# EasyEDA Pro project split36_right.eprj

# Schematic split1_right
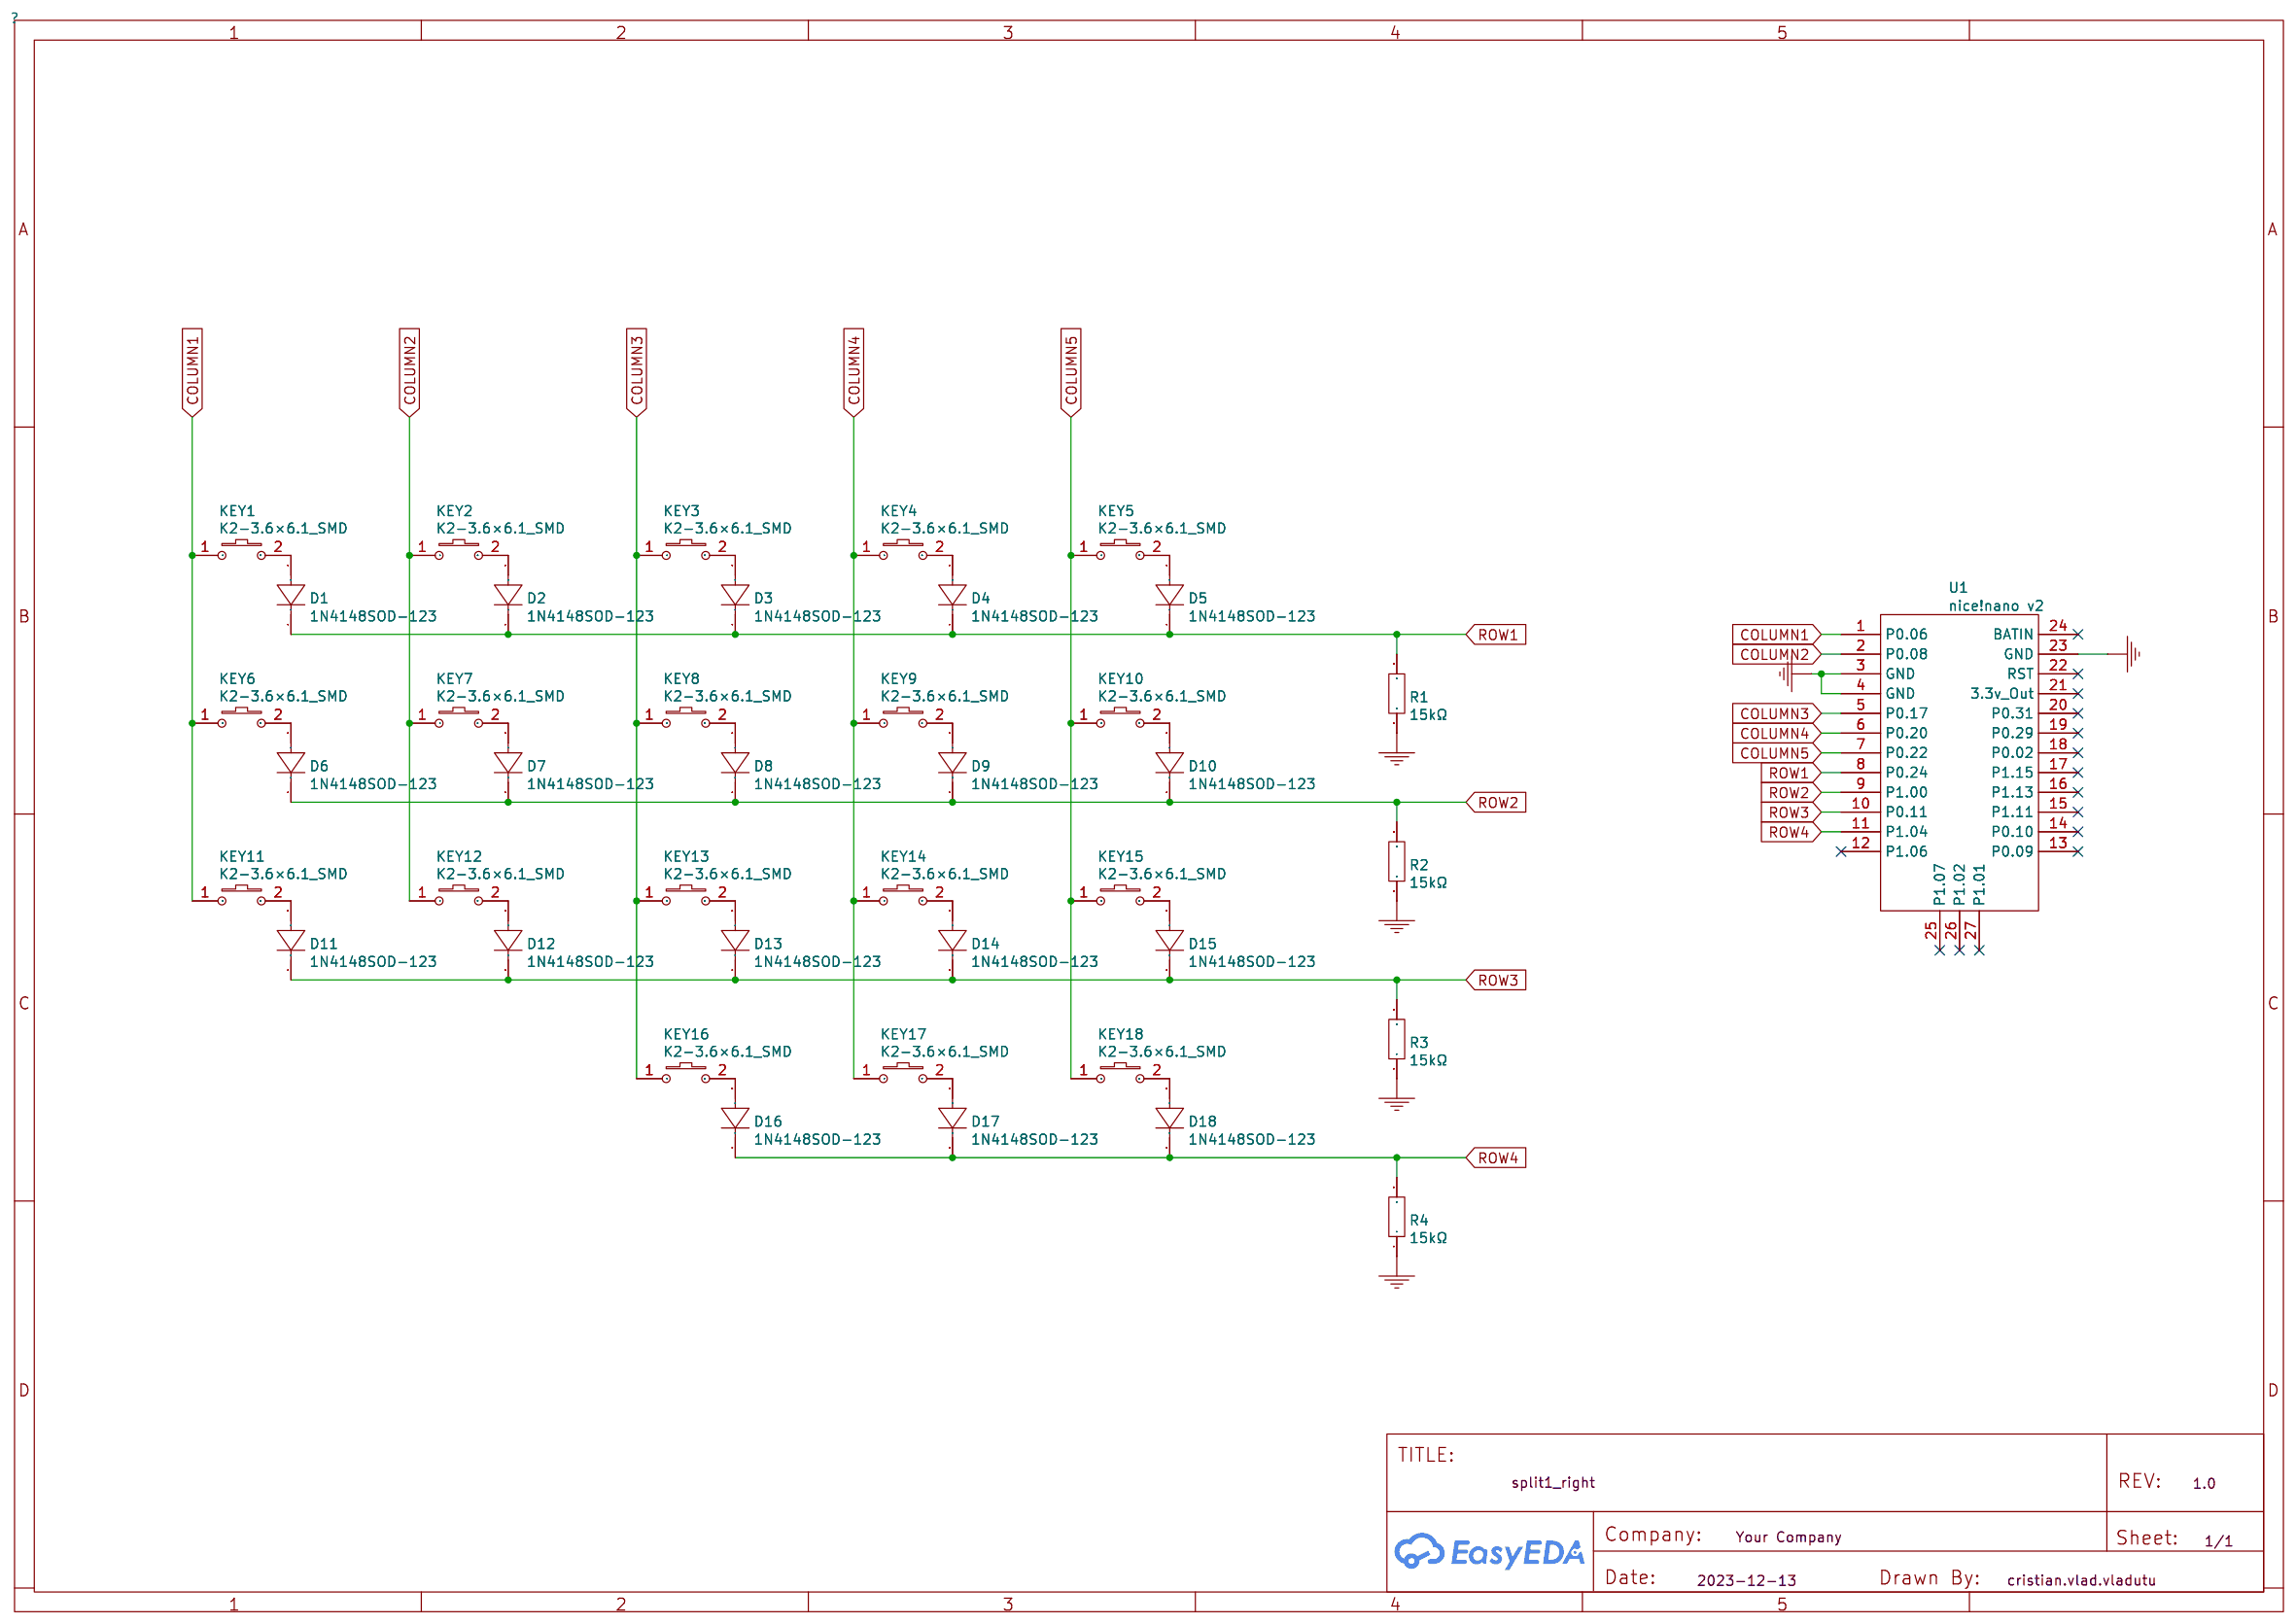
[diagram p0: schematic sheet]

## Parts
D1  1N4148SOD-123  [SOD-123_L2.6-W1.6-LS3.5-RD]
D2  1N4148SOD-123  [SOD-123_L2.6-W1.6-LS3.5-RD]
D3  1N4148SOD-123  [SOD-123_L2.6-W1.6-LS3.5-RD]
D4  1N4148SOD-123  [SOD-123_L2.6-W1.6-LS3.5-RD]
D5  1N4148SOD-123  [SOD-123_L2.6-W1.6-LS3.5-RD]
D6  1N4148SOD-123  [SOD-123_L2.6-W1.6-LS3.5-RD]
D7  1N4148SOD-123  [SOD-123_L2.6-W1.6-LS3.5-RD]
D8  1N4148SOD-123  [SOD-123_L2.6-W1.6-LS3.5-RD]
D9  1N4148SOD-123  [SOD-123_L2.6-W1.6-LS3.5-RD]
D10  1N4148SOD-123  [SOD-123_L2.6-W1.6-LS3.5-RD]
D11  1N4148SOD-123  [SOD-123_L2.6-W1.6-LS3.5-RD]
D12  1N4148SOD-123  [SOD-123_L2.6-W1.6-LS3.5-RD]
D13  1N4148SOD-123  [SOD-123_L2.6-W1.6-LS3.5-RD]
D14  1N4148SOD-123  [SOD-123_L2.6-W1.6-LS3.5-RD]
D15  1N4148SOD-123  [SOD-123_L2.6-W1.6-LS3.5-RD]
D16  1N4148SOD-123  [SOD-123_L2.6-W1.6-LS3.5-RD]
D17  1N4148SOD-123  [SOD-123_L2.6-W1.6-LS3.5-RD]
D18  1N4148SOD-123  [SOD-123_L2.6-W1.6-LS3.5-RD]
KEY1  K2-3.6×6.1_SMD  [GATERON LOW PROFILE SWITCH HOTSWAP LED]
KEY2  K2-3.6×6.1_SMD  [GATERON LOW PROFILE SWITCH HOTSWAP LED]
KEY3  K2-3.6×6.1_SMD  [GATERON LOW PROFILE SWITCH HOTSWAP LED]
KEY4  K2-3.6×6.1_SMD  [GATERON LOW PROFILE SWITCH HOTSWAP LED]
KEY5  K2-3.6×6.1_SMD  [GATERON LOW PROFILE SWITCH HOTSWAP LED]
KEY6  K2-3.6×6.1_SMD  [GATERON LOW PROFILE SWITCH HOTSWAP LED]
KEY7  K2-3.6×6.1_SMD  [GATERON LOW PROFILE SWITCH HOTSWAP LED]
KEY8  K2-3.6×6.1_SMD  [GATERON LOW PROFILE SWITCH HOTSWAP LED]
KEY9  K2-3.6×6.1_SMD  [GATERON LOW PROFILE SWITCH HOTSWAP LED]
KEY10  K2-3.6×6.1_SMD  [GATERON LOW PROFILE SWITCH HOTSWAP LED]
KEY11  K2-3.6×6.1_SMD  [GATERON LOW PROFILE SWITCH HOTSWAP LED]
KEY12  K2-3.6×6.1_SMD  [GATERON LOW PROFILE SWITCH HOTSWAP LED]
KEY13  K2-3.6×6.1_SMD  [GATERON LOW PROFILE SWITCH HOTSWAP LED]
KEY14  K2-3.6×6.1_SMD  [GATERON LOW PROFILE SWITCH HOTSWAP LED]
KEY15  K2-3.6×6.1_SMD  [GATERON LOW PROFILE SWITCH HOTSWAP LED]
KEY16  K2-3.6×6.1_SMD  [GATERON LOW PROFILE SWITCH HOTSWAP LED]
KEY17  K2-3.6×6.1_SMD  [GATERON LOW PROFILE SWITCH HOTSWAP LED]
KEY18  K2-3.6×6.1_SMD  [GATERON LOW PROFILE SWITCH HOTSWAP LED]
R1  15kΩ  [R0402]
R2  15kΩ  [R0402]
R3  15kΩ  [R0402]
R4  15kΩ  [R0402]
U1  nice!nano v2  [NICE!NANO V2]

## Library data of the parts
D1-D18 = 1N4148SOD-123: link: https://lcsc.com/eda_search?q=C2972760&amp;%26type=1&amp;ref=editor; Supplier: LCSC; Supplier Part: C2972760; Manufacturer: JKSEMI(金开盛); JLCPCB Part Class: Extended Part
KEY1-KEY18 = K2-3.6×6.1_SMD: Supplier Part: C118141; Supplier: LCSC; Manufacturer Part: K2-1107ST-A4SW-06; 制造商: 韩国韩荣
R1-R4 = 15kΩ: link: https://lcsc.com/eda_search?q=C325957&amp;%26type=1&amp;ref=editor; 3DModel: R0402_L1.0-W0.5-H0.5; Supplier: LCSC; Supplier Part: C325957; Manufacturer: Tyohm(幸亚电阻); Manufacturer Part: RMC040215K5%N; JLCPCB Part Class: Extended Part
U1 = nice!nano v2: link: https://nicekeyboards.com/docs/nice-nano/pinout-schematic; Manufacturer: nice!

## Nets
GND: R1.1 R2.1 R3.1 R4.1 U1.3(GND) U1.4(GND) U1.23(GND)
COLUMN1: KEY1.1 KEY6.1 KEY11.1 U1.1(P0.06)
COLUMN2: KEY2.1 KEY7.1 KEY12.1 U1.2(P0.08)
COLUMN3: KEY3.1 KEY8.1 KEY13.1 KEY16.1 U1.5(P0.17)
COLUMN4: KEY4.1 KEY9.1 KEY14.1 KEY17.1 U1.6(P0.20)
COLUMN5: KEY5.1 KEY10.1 KEY15.1 KEY18.1 U1.7(P0.22)
ROW1: D1.1(K) D2.1(K) D3.1(K) D4.1(K) D5.1(K) R1.2 U1.8(P0.24)
ROW2: D6.1(K) D7.1(K) D8.1(K) D9.1(K) D10.1(K) R2.2 U1.9(P1.00)
ROW3: D11.1(K) D12.1(K) D13.1(K) D14.1(K) D15.1(K) R3.2 U1.10(P0.11)
ROW4: D16.1(K) D17.1(K) D18.1(K) R4.2 U1.11(P1.04)
$1N745: D1.2(A) KEY1.2
$1N746: D2.2(A) KEY2.2
$1N747: D3.2(A) KEY3.2
$1N748: D4.2(A) KEY4.2
$1N749: D5.2(A) KEY5.2
$1N750: D10.2(A) KEY10.2
$1N751: D8.2(A) KEY8.2
$1N752: D7.2(A) KEY7.2
$1N753: D15.2(A) KEY15.2
$1N754: D14.2(A) KEY14.2
$1N755: D13.2(A) KEY13.2
$1N756: D12.2(A) KEY12.2
$1N757: D11.2(A) KEY11.2
$1N758: D16.2(A) KEY16.2
$1N759: D17.2(A) KEY17.2
$1N760: D18.2(A) KEY18.2
$1N761: D6.2(A) KEY6.2
$1N762: D9.2(A) KEY9.2

Not connected (* = marked no-connect by the designer): U1 12(P1.06)* 13(P0.09)* 14(P0.10)* 15(P1.11)* 16(P1.13)* 17(P1.15)* 18(P0.02)* 19(P0.29)* 20(P0.31)* 21(3.3v Out)* 22(RST)* 24(BATIN)* 25(P1.07)* 26(P1.02)* 27(P1.01)*

# Board PCB_split1_right
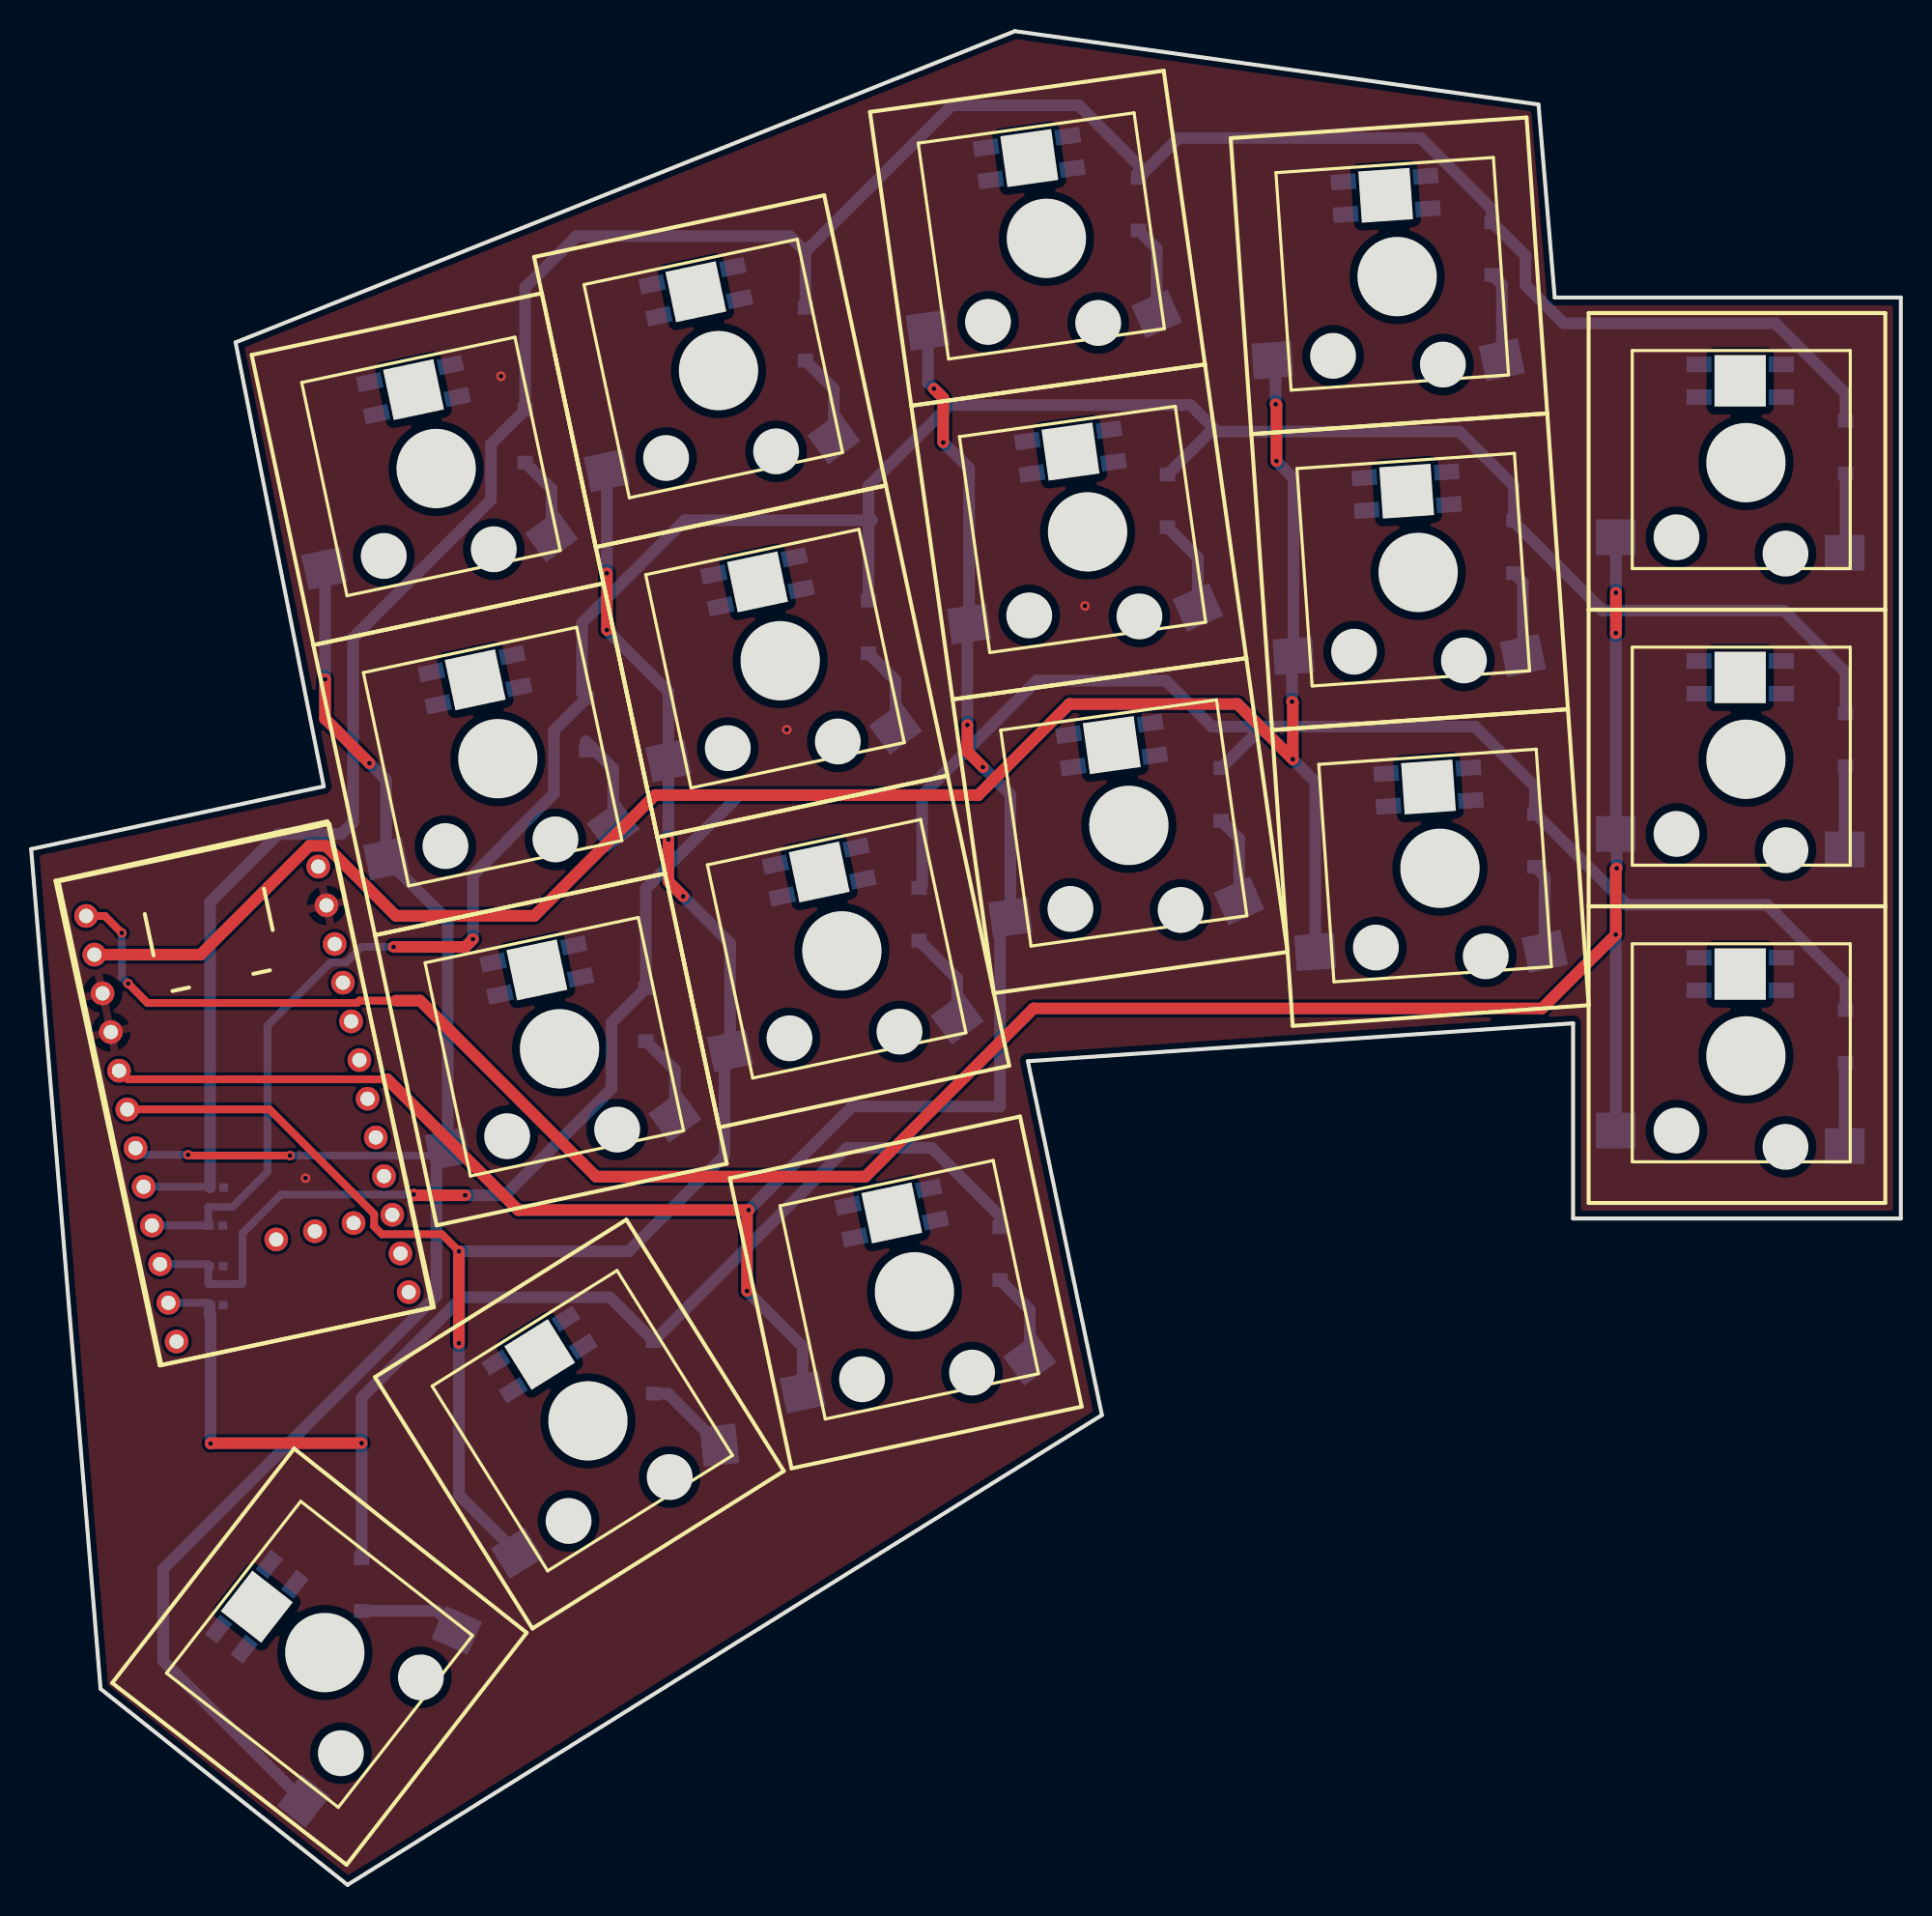
[diagram p1: board, top side]
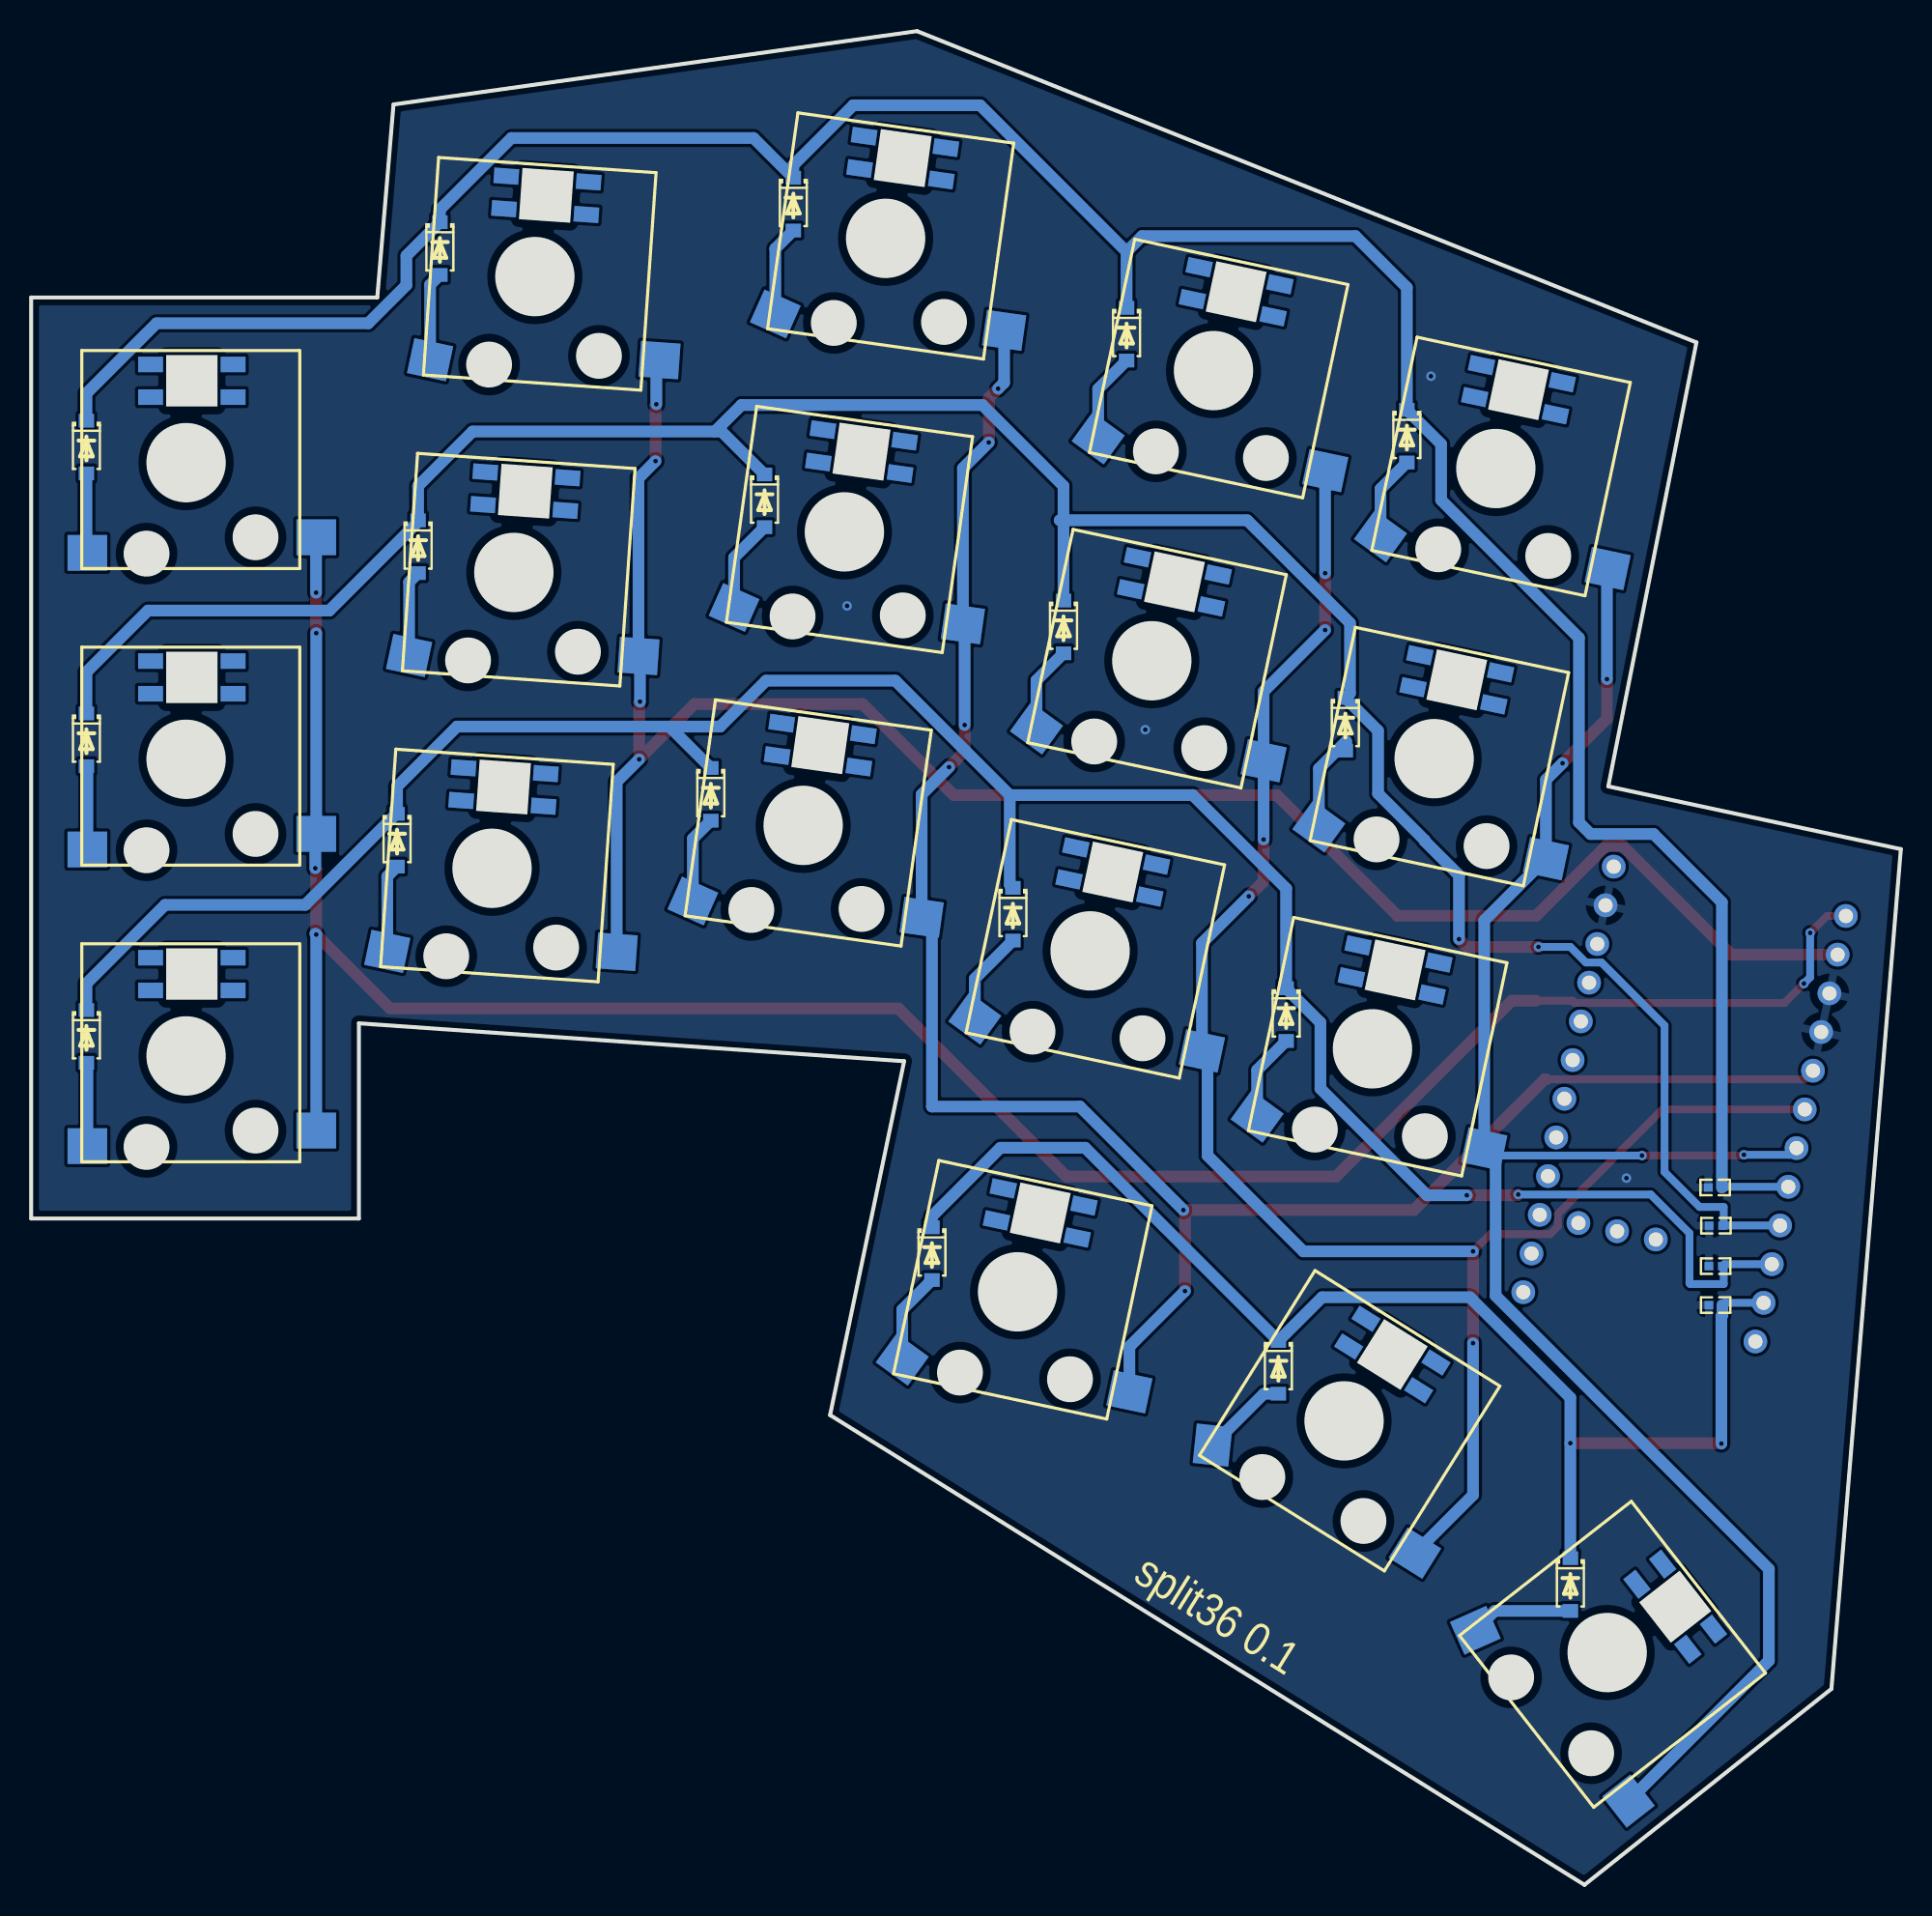
[diagram p2: board, bottom side, seen from below]

Outline 120.08 x 119.05 mm; copper layers: Top Layer, Bottom Layer. Coordinates in mm from the lower left corner of the outline.
Outline path: 0,66.52 18.79,70.55 13.13,99.06 63.18,119.05 96.81,114.34 97.85,101.94 120.08,101.94 120.08,42.79 99.03,42.79 99.03,55.33 64.01,52.9 68.77,30.17 20.32,0 4.46,12.59 0,66.52
Stack: Top Layer 0.035mm / Dielectric1 1.51mm FR4 er 4.5 / Bottom Layer 0.035mm

## Design rules (mm)
spacing Default (default): track to track 0.152, other pairs 0 to 0.152
track width Default (default): min 0.254, default 0.254, max 25.4
differential pair differentialPair (default): width min 0.127, default 0.254, max 2.54; gap min 0.152, default 0.152
via Default (default): diameter min 0.61, default 0.61, max 100.025; hole min 0.305, default 0.305, max 59.995
net GND uses gge22613(1)
pour e135 uses gge22613

## Placement (name value [footprint] x y rotation side)
D1  1N4148SOD-123  [SOD-123_L2.6-W1.6-LS3.5-RD]  116.53 92.34 270 bottom
D2  1N4148SOD-123  [SOD-123_L2.6-W1.6-LS3.5-RD]  93.83 105.09 270 bottom
D3  1N4148SOD-123  [SOD-123_L2.6-W1.6-LS3.5-RD]  71.13 107.94 270 bottom
D4  1N4148SOD-123  [SOD-123_L2.6-W1.6-LS3.5-RD]  49.73 99.59 270 bottom
D5  1N4148SOD-123  [SOD-123_L2.6-W1.6-LS3.5-RD]  31.73 93.04 270 bottom
D6  1N4148SOD-123  [SOD-123_L2.6-W1.6-LS3.5-RD]  116.53 73.54 270 bottom
D7  1N4148SOD-123  [SOD-123_L2.6-W1.6-LS3.5-RD]  95.23 85.94 270 bottom
D8  1N4148SOD-123  [SOD-123_L2.6-W1.6-LS3.5-RD]  72.98 88.89 270 bottom
D9  1N4148SOD-123  [SOD-123_L2.6-W1.6-LS3.5-RD]  53.78 80.79 270 bottom
D10  1N4148SOD-123  [SOD-123_L2.6-W1.6-LS3.5-RD]  35.68 74.54 270 bottom
D11  1N4148SOD-123  [SOD-123_L2.6-W1.6-LS3.5-RD]  116.53 54.49 270 bottom
D12  1N4148SOD-123  [SOD-123_L2.6-W1.6-LS3.5-RD]  96.58 67.09 270 bottom
D13  1N4148SOD-123  [SOD-123_L2.6-W1.6-LS3.5-RD]  76.43 70.04 270 bottom
D14  1N4148SOD-123  [SOD-123_L2.6-W1.6-LS3.5-RD]  57.03 62.34 270 bottom
D15  1N4148SOD-123  [SOD-123_L2.6-W1.6-LS3.5-RD]  39.48 55.89 270 bottom
D16  1N4148SOD-123  [SOD-123_L2.6-W1.6-LS3.5-RD]  62.23 40.54 270 bottom
D17  1N4148SOD-123  [SOD-123_L2.6-W1.6-LS3.5-RD]  39.98 33.24 270 bottom
D18  1N4148SOD-123  [SOD-123_L2.6-W1.6-LS3.5-RD]  21.23 19.29 270 bottom
KEY1  K2-3.6×6.1_SMD  [GATERON LOW PROFILE SWITCH HOTSWAP LED#2]  110.13 91.34 0 top
KEY2  K2-3.6×6.1_SMD  [GATERON LOW PROFILE SWITCH HOTSWAP LED#3]  87.73 103.29 4 top
KEY3  K2-3.6×6.1_SMD  [GATERON LOW PROFILE SWITCH HOTSWAP LED]  65.2 105.74 8 top
KEY4  K2-3.6×6.1_SMD  [GATERON LOW PROFILE SWITCH HOTSWAP LED#4]  44.14 97.25 12 top
KEY5  K2-3.6×6.1_SMD  [GATERON LOW PROFILE SWITCH HOTSWAP LED#4]  26.01 90.96 12 top
KEY6  K2-3.6×6.1_SMD  [GATERON LOW PROFILE SWITCH HOTSWAP LED#2]  110.13 72.29 0 top
KEY7  K2-3.6×6.1_SMD  [GATERON LOW PROFILE SWITCH HOTSWAP LED#3]  89.08 84.29 4 top
KEY8  K2-3.6×6.1_SMD  [GATERON LOW PROFILE SWITCH HOTSWAP LED]  67.85 86.89 8 top
KEY9  K2-3.6×6.1_SMD  [GATERON LOW PROFILE SWITCH HOTSWAP LED#4]  48.11 78.61 12 top
KEY10  K2-3.6×6.1_SMD  [GATERON LOW PROFILE SWITCH HOTSWAP LED#4]  29.97 72.33 12 top
KEY11  K2-3.6×6.1_SMD  [GATERON LOW PROFILE SWITCH HOTSWAP LED#2]  110.13 53.24 0 top
KEY12  K2-3.6×6.1_SMD  [GATERON LOW PROFILE SWITCH HOTSWAP LED#3]  90.48 65.29 4 top
KEY13  K2-3.6×6.1_SMD  [GATERON LOW PROFILE SWITCH HOTSWAP LED]  70.5 68.04 8 top
KEY14  K2-3.6×6.1_SMD  [GATERON LOW PROFILE SWITCH HOTSWAP LED#4]  52.07 59.98 12 top
KEY15  K2-3.6×6.1_SMD  [GATERON LOW PROFILE SWITCH HOTSWAP LED#4]  33.94 53.69 12 top
KEY16  K2-3.6×6.1_SMD  [GATERON LOW PROFILE SWITCH HOTSWAP LED#4]  56.73 38.09 12 top
KEY17  K2-3.6×6.1_SMD  [GATERON LOW PROFILE SWITCH HOTSWAP LED#5]  35.76 29.8 32 top
KEY18  K2-3.6×6.1_SMD  [GATERON LOW PROFILE SWITCH HOTSWAP LED#6]  18.86 14.92 52 top
R1  15kΩ  [R0402]  11.93 44.79 180 bottom
R2  15kΩ  [R0402]  11.88 42.34 180 bottom
R3  15kΩ  [R0402]  11.89 39.74 180 bottom
R4  15kΩ  [R0402]  11.89 37.24 180 bottom
U1  nice!nano v2  [NICE!NANO V2]  13.63 51.39 12 top

## Footprints (pads in the part's own frame, mm; a bottom-side part is the same pattern mirrored in y, then rotated)
GATERON LOW PROFILE SWITCH HOTSWAP LED
  rect 2.55x2.3 smd far side: 1(-8.36,-4.792)
  custom 2.55x2.3 smd far side rot 16: 2(6.34,-5.792)
  rect 1.6x1 smd far side: B(-3.02,4.208) G(2.28,4.208) GND(-3.02,6.308) R(2.28,6.308)
GATERON LOW PROFILE SWITCH HOTSWAP LED#2
  rect 2.55x2.3 smd far side: 1(-8.36,-4.792)
  custom 2.55x2.3 smd far side: 2(6.34,-5.792)
  rect 1.6x1 smd far side: B(-3.02,4.208) G(2.28,4.208) GND(-3.02,6.308) R(2.28,6.308)
GATERON LOW PROFILE SWITCH HOTSWAP LED#3
  rect 2.55x2.3 smd far side: 1(-8.36,-4.792)
  custom 2.55x2.3 smd far side rot 8: 2(6.34,-5.792)
  rect 1.6x1 smd far side: B(-3.02,4.208) G(2.28,4.208) GND(-3.02,6.308) R(2.28,6.308)
GATERON LOW PROFILE SWITCH HOTSWAP LED#4
  rect 2.55x2.3 smd far side: 1(-8.36,-4.792)
  custom 2.55x2.3 smd far side rot 24: 2(6.34,-5.792)
  rect 1.6x1 smd far side: B(-3.02,4.208) G(2.28,4.208) GND(-3.02,6.308) R(2.28,6.308)
GATERON LOW PROFILE SWITCH HOTSWAP LED#5
  rect 2.55x2.3 smd far side: 1(-8.36,-4.792)
  custom 2.55x2.3 smd far side rot 64: 2(6.34,-5.792)
  rect 1.6x1 smd far side: B(-3.02,4.208) G(2.28,4.208) GND(-3.02,6.308) R(2.28,6.308)
GATERON LOW PROFILE SWITCH HOTSWAP LED#6
  rect 2.55x2.3 smd far side: 1(-8.36,-4.792)
  custom 2.55x2.3 smd far side rot 104: 2(6.34,-5.792)
  rect 1.6x1 smd far side: B(-3.02,4.208) G(2.28,4.208) GND(-3.02,6.308) R(2.28,6.308)
NICE!NANO V2
  round 1.524 hole 0.914: 1(-7.62,12.7) 2(-7.62,10.16) 3(-7.62,7.62) 4(-7.62,5.08) 5(-7.62,2.54) 6(-7.62,0) 7(-7.62,-2.54) 8(-7.62,-5.08) 9(-7.62,-7.62) 10(-7.62,-10.16) 11(-7.62,-12.7) 12(-7.62,-15.24) 13(7.62,-15.24) 14(7.62,-12.7) 15(7.62,-10.16) 16(7.62,-7.62) 17(7.62,-5.08) 18(7.62,-2.54) 19(7.62,0) 20(7.62,2.54) 21(7.62,5.08) 22(7.62,7.62) 23(7.62,10.16) 24(7.62,12.7) 25(0,-10.16) 26(2.54,-10.16) 27(5.08,-10.16)
R0402
  rect 0.566x0.54 smd: 1(-0.433,0) 2(0.433,0)
SOD-123_L2.6-W1.6-LS3.5-RD
  rect 0.88x0.99 smd: 1(-1.692,0) 2(1.692,0)

## Nets
As in the schematic.

Pads without a net: KEY1 B G GND R; KEY2 B G GND R; KEY3 B G GND R; KEY4 B G GND R; KEY5 B G GND R; KEY6 B G GND R; KEY7 B G GND R; KEY8 B G GND R; KEY9 B G GND R; KEY10 B G GND R; KEY11 B G GND R; KEY12 B G GND R; KEY13 B G GND R; KEY14 B G GND R; KEY15 B G GND R; KEY16 B G GND R; KEY17 B G GND R; KEY18 B G GND R; U1 12 13 14 15 16 17 18 19 20 21 22 24 25 26 27

## Via types
v1: diameter 0.61, hole 0.305, Top Layer to Bottom Layer, 36 vias

## Routing (per net, layer and track width the routed paths; a pad name or vN(x,y) marks a point on that pad's centre or on a via; arc(x,y) is an arc through that point)
GND:
  vias: v1(17.63,45.39) v1(30.18,96.89) v1(48.53,74.19) v1(67.68,82.14)
COLUMN1: length 151.6
  Top Layer w0.5: U1.1 4.74,62.22 v1(5.83,61.14) ; 23.43,56.79 21.08,56.79 20.93,56.64 7.48,56.64 v1(6.23,57.89)
  Top Layer w0.75: v1(101.78,82.99) 101.78,80.4 v1(101.77,80.39) ; 23.43,56.79 24.98,56.79 36.28,45.49 53.58,45.49 64.38,56.29 97.03,56.29 v1(101.77,61.03) 101.77,65.23 v1(101.83,65.29)
  Bottom Layer w0.5: v1(6.23,57.89) 5.83,58.29 v1(5.83,61.14)
  Bottom Layer w0.75: KEY1.1 101.78,86.53 v1(101.78,82.99) ; KEY11.1 v1(101.77,61.03) 101.83,61.09 ; v1(101.77,80.39) KEY6.1 101.83,67.43 v1(101.83,65.29)
COLUMN2: length 128
  Top Layer w0.75: v1(80.98,75.99) 81.03,75.94 v1(81.03,72.29) 77.48,75.84 66.68,75.84 60.83,69.99 40.08,69.99 32.33,62.24 23.42,62.24 18.93,66.73 17.87,66.73 10.88,59.74 U1.2 ; v1(79.98,91.44) 79.98,95.04 v1(79.93,95.09)
  Bottom Layer w0.75: v1(79.93,95.09) 79.93,97.72 KEY2.1 ; v1(81.03,72.29) 82.47,70.84 KEY12.1 ; v1(79.98,91.44) 81.07,90.34 KEY7.1 80.98,78.83 v1(80.98,75.99)
COLUMN3: length 128.6
  Top Layer w0.5: U1.5 6.19,51.74 22.78,51.74
  Top Layer w0.75: 22.78,51.74 22.88,51.74 31.28,43.34 v1(46.08,43.34) 45.98,43.24 v1(45.98,38.14) ; v1(58.58,92.64) 58.58,95.49 v1(57.98,96.09) ; v1(61.13,71.79) 60.13,72.79 v1(60.13,74.49)
  Bottom Layer w0.75: KEY16.1 49.55,34.57 v1(45.98,38.14) ; v1(61.13,71.79) 62.88,70.03 KEY13.1 62.23,61.47 62.23,49.99 52.73,49.99 v1(46.08,43.34) ; v1(60.13,74.49) 60.13,80.87 KEY8.1 60.24,90.98 v1(58.58,92.64) ; v1(57.98,96.09) 57.59,96.47 KEY3.1
COLUMN4: length 113.5
  Top Layer w0.5: v1(27.48,40.69) 26.38,41.79 22.53,41.79 22.03,42.29 22.03,43.09 15.31,49.8 U1.6
  Top Layer w0.75: v1(36.98,80.59) v1(36.98,84.24) ; v1(40.93,67.14) 40.93,64.44 v1(41.88,63.49) ; v1(27.48,34.79) v1(27.48,40.69)
  Bottom Layer w0.75: v1(36.98,80.59) 40.93,76.64 v1(40.93,67.14) ; v1(27.48,40.69) 38.38,40.69 44.53,46.84 44.53,53.2 44.89,53.56 44.89,60.48 v1(41.88,63.49) ; v1(36.98,84.24) 36.98,90.81 KEY4.1 ; KEY17.1 27.48,25.04 v1(27.48,34.79)
COLUMN5: length 113.6
  Top Layer w0.5: v1(16.63,46.84) 10.13,46.84 v1(10.08,46.89)
  Top Layer w0.75: v1(18.88,77.44) 18.88,74.89 v1(21.73,72.04)
  Bottom Layer w0.5: v1(10.08,46.89) 7.13,46.89 U1.7 ; v1(16.63,46.84) 26.32,46.84
  Bottom Layer w0.75: v1(18.88,77.44) 18.88,84.49 KEY5.1 ; KEY18.1 8.48,14.39 8.48,20.29 26.03,37.84 26.03,46.54 KEY15.1 26.75,61.94 22.79,65.9 22.79,70.97 v1(21.73,72.04)
ROW1: length 180.5
  Bottom Layer w0.5: R1.2 11.45,44.83 7.23,44.83
  Bottom Layer w0.75: D1.1 116.53,95.79 112.03,100.29 98.43,100.29 95.98,102.74 95.98,104.63 D2.1 93.83,107.59 89.23,112.19 73.68,112.19 D3.1 71.13,110.44 67.28,114.29 59.13,114.29 49.73,104.89 ; 49.73,104.89 48.73,105.89 35.03,105.89 31.73,102.59 D5.1 29.53,92.53 29.53,88.94 20.68,80.09 20.68,68.24 19.93,67.49 15.88,67.49 11.49,63.1 R1.2 ; 49.73,104.89 D4.1
ROW2: length 167.1
  Top Layer w0.75: v1(23.28,60.24) 27.88,60.24 v1(28.38,60.74)
  Bottom Layer w0.5: 11.43,42.35 11.38,42.4 11.38,43.54 12.93,43.54 15.18,45.79 15.18,55.19 19.23,59.24 20.23,59.24 21.23,60.24 v1(23.28,60.24) ; 11.43,42.35 7.76,42.35 ; 11.43,42.35 R2.2
  Bottom Layer w0.75: 76.16,93.34 75.73,93.34 D8.1 ; 76.16,93.34 91.73,93.34 95.23,89.84 D7.1 95.23,87.54 100.93,81.84 112.58,81.84 116.53,77.89 D6.1 ; 76.16,93.34 74.46,95.04 58.98,95.04 53.78,89.84 53.78,87.64 ; 53.78,87.64 D9.1 ; 53.78,87.64 41.98,87.64 35.38,81.04 35.38,76.53 D10.1 33.58,74.13 33.58,70.09 30.58,67.09 30.58,67.04 28.38,64.84 v1(28.38,60.74) ; 53.78,87.64 54.03,87.64
ROW3: length 154.4
  Top Layer w0.75: v1(24.58,44.34) 24.63,44.29 v1(27.88,44.29)
  Bottom Layer w0.5: v1(24.58,44.34) 16.06,44.34 13.58,41.85 13.58,38.64 13.53,38.59 11.38,38.59 11.38,39.65 R3.2 11.33,39.86 8.29,39.86
  Bottom Layer w0.75: D11.1 116.53,57.89 111.48,62.94 102.48,62.94 96.63,68.78 D12.1 96.58,70.54 92.73,74.39 79.08,74.39 ; 79.08,74.39 D13.1 ; 79.08,74.39 75.83,74.39 72.88,77.34 64.58,77.34 57.23,69.99 ; 57.23,69.99 45.48,69.99 39.48,63.99 D15.1 37.28,55.38 37.28,51.14 30.43,44.29 v1(27.88,44.29) ; 57.23,69.99 57.23,64.23 D14.1
ROW4: length 84.2
  Top Layer w0.75: v1(21.23,28.37) 11.56,28.37 v1(11.53,28.34)
  Bottom Layer w0.5: 8.81,37.38 11.32,37.38 R4.2
  Bottom Layer w0.75: 21.23,20.98 v1(21.23,28.37) 21.23,31.29 27.68,37.74 37.17,37.74 39.98,34.93 52.38,47.34 57.83,47.34 62.23,42.94 D16.1 ; R4.2 11.46,36.59 11.53,36.52 v1(11.53,28.34)
$1N745: length 5.1
  Bottom Layer w0.75: D1.2 116.53,85.6 KEY1.2
$1N746: length 5.7
  Bottom Layer w0.75: D2.2 94.46,102.76 KEY2.2
$1N747: length 5.8
  Bottom Layer w0.75: 72.29,100.89 72.29,105.08 D3.2
$1N748: length 5.7
  Bottom Layer w0.75: 51.55,92.9 51.55,96.07 D4.2
$1N749: length 5.4
  Bottom Layer w0.75: KEY5.2 33.42,89.65 D5.2
$1N750: length 6.8
  Bottom Layer w0.75: D10.2 35.63,72.89 35.63,73.44 37.38,71.68 KEY10.2
$1N751: length 6
  Bottom Layer w0.75: KEY8.2 74.93,85.24 D8.2
$1N752: length 5.5
  Bottom Layer w0.75: D7.2 95.81,83.66 KEY7.2
$1N753: length 5.6
  Bottom Layer w0.75: D15.2 41.34,52.33 KEY15.2
$1N754: length 6
  Bottom Layer w0.75: D14.2 59.47,58.2 KEY14.2
$1N755: length 5.6
  Bottom Layer w0.75: D13.2 77.58,67.19 KEY13.2
$1N756: length 5.7
  Bottom Layer w0.75: D12.2 97.21,64.76 KEY12.2
$1N757: length 5.4
  Bottom Layer w0.75: KEY11.2 116.47,52.73 D11.2
$1N758: length 5.9
  Bottom Layer w0.75: D16.2 64.13,36.94 64.13,33.74
$1N759: length 5.6
  Bottom Layer w0.75: KEY17.2 40.91,31.54 D17.2
$1N760: length 6.6
  Bottom Layer w0.75: D18.2 26.08,17.59 27.33,16.35
$1N761: length 5.4
  Bottom Layer w0.75: D6.2 116.47,71.78 KEY6.2
$1N762: length 5.5
  Bottom Layer w0.75: KEY9.2 55.51,77.36 D9.2

## Copper pours and planes (outline as drawn; the poured copper is in the pictures)
GND on Top Layer: 127.18,126.14 132.68,120.64 132.68,9.14 106.68,-16.86 -0.82,-16.86 -12.82,-4.86 -12.82,125.64 -12.32,126.14
GND on Bottom Layer: -9.42,124.54 130.08,124.54 135.58,119.04 135.58,7.54 109.58,-18.46 2.08,-18.46 -9.92,-6.46 -9.92,124.04

## Text on the board
Bottom Silkscreen Layer: split36 0.1
